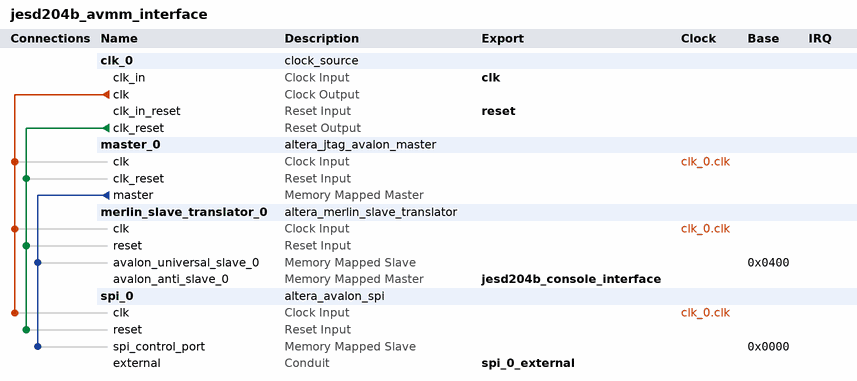
[diagram p0: system contents]
# Platform Designer (Qsys) system jesd204b_avmm_interface, Arria V 5AGTFD7K3F40I3
# Parameters at their usual value, and those the tool derives, are not listed.
package require -exact qsys 14.0
create_system jesd204b_avmm_interface
set_project_property DEVICE_FAMILY {Arria V}
set_project_property DEVICE 5AGTFD7K3F40I3

add_instance clk_0 clock_source 14.0
set_instance_parameter_value clk_0 clockFrequency 100000000

add_instance master_0 altera_jtag_avalon_master 14.0

add_instance merlin_slave_translator_0 altera_merlin_slave_translator 14.0
set_instance_parameter_value merlin_slave_translator_0 AV_ADDRESS_W 10
set_instance_parameter_value merlin_slave_translator_0 AV_DATA_W 32
set_instance_parameter_value merlin_slave_translator_0 UAV_DATA_W 32
set_instance_parameter_value merlin_slave_translator_0 AV_BURSTCOUNT_W 4
set_instance_parameter_value merlin_slave_translator_0 AV_BYTEENABLE_W 4
set_instance_parameter_value merlin_slave_translator_0 UAV_BYTEENABLE_W 4
set_instance_parameter_value merlin_slave_translator_0 UAV_ADDRESS_W 10
set_instance_parameter_value merlin_slave_translator_0 UAV_BURSTCOUNT_W 4
set_instance_parameter_value merlin_slave_translator_0 AV_READLATENCY 1
set_instance_parameter_value merlin_slave_translator_0 AV_SETUP_WAIT 0
set_instance_parameter_value merlin_slave_translator_0 AV_WRITE_WAIT 0
set_instance_parameter_value merlin_slave_translator_0 AV_READ_WAIT 1
set_instance_parameter_value merlin_slave_translator_0 AV_DATA_HOLD 0
set_instance_parameter_value merlin_slave_translator_0 AV_TIMING_UNITS 1
set_instance_parameter_value merlin_slave_translator_0 USE_READDATA 1
set_instance_parameter_value merlin_slave_translator_0 USE_WRITEDATA 1
set_instance_parameter_value merlin_slave_translator_0 USE_READ 1
set_instance_parameter_value merlin_slave_translator_0 USE_WRITE 1
set_instance_parameter_value merlin_slave_translator_0 USE_BEGINBURSTTRANSFER 0
set_instance_parameter_value merlin_slave_translator_0 USE_BEGINTRANSFER 0
set_instance_parameter_value merlin_slave_translator_0 USE_BYTEENABLE 0
set_instance_parameter_value merlin_slave_translator_0 USE_CHIPSELECT 1
set_instance_parameter_value merlin_slave_translator_0 USE_ADDRESS 1
set_instance_parameter_value merlin_slave_translator_0 USE_BURSTCOUNT 0
set_instance_parameter_value merlin_slave_translator_0 USE_READDATAVALID 0
set_instance_parameter_value merlin_slave_translator_0 USE_WAITREQUEST 1
set_instance_parameter_value merlin_slave_translator_0 USE_WRITEBYTEENABLE 0
set_instance_parameter_value merlin_slave_translator_0 USE_LOCK 0
set_instance_parameter_value merlin_slave_translator_0 USE_AV_CLKEN 0
set_instance_parameter_value merlin_slave_translator_0 USE_UAV_CLKEN 0
set_instance_parameter_value merlin_slave_translator_0 USE_OUTPUTENABLE 0
set_instance_parameter_value merlin_slave_translator_0 USE_DEBUGACCESS 0
set_instance_parameter_value merlin_slave_translator_0 USE_READRESPONSE 0
set_instance_parameter_value merlin_slave_translator_0 USE_WRITERESPONSE 0
set_instance_parameter_value merlin_slave_translator_0 AV_SYMBOLS_PER_WORD 4
set_instance_parameter_value merlin_slave_translator_0 AV_ADDRESS_SYMBOLS 1
set_instance_parameter_value merlin_slave_translator_0 AV_BURSTCOUNT_SYMBOLS 1
set_instance_parameter_value merlin_slave_translator_0 AV_CONSTANT_BURST_BEHAVIOR 0
set_instance_parameter_value merlin_slave_translator_0 UAV_CONSTANT_BURST_BEHAVIOR 0
set_instance_parameter_value merlin_slave_translator_0 AV_REQUIRE_UNALIGNED_ADDRESSES 0
set_instance_parameter_value merlin_slave_translator_0 AV_LINEWRAPBURSTS 0
set_instance_parameter_value merlin_slave_translator_0 AV_MAX_PENDING_READ_TRANSACTIONS 64
set_instance_parameter_value merlin_slave_translator_0 AV_MAX_PENDING_WRITE_TRANSACTIONS 0
set_instance_parameter_value merlin_slave_translator_0 AV_BURSTBOUNDARIES 0
set_instance_parameter_value merlin_slave_translator_0 AV_INTERLEAVEBURSTS 0
set_instance_parameter_value merlin_slave_translator_0 AV_BITS_PER_SYMBOL 8
set_instance_parameter_value merlin_slave_translator_0 AV_ISBIGENDIAN 0
set_instance_parameter_value merlin_slave_translator_0 AV_ADDRESSGROUP 0
set_instance_parameter_value merlin_slave_translator_0 UAV_ADDRESSGROUP 0
set_instance_parameter_value merlin_slave_translator_0 AV_REGISTEROUTGOINGSIGNALS 0
set_instance_parameter_value merlin_slave_translator_0 AV_REGISTERINCOMINGSIGNALS 0
set_instance_parameter_value merlin_slave_translator_0 AV_ALWAYSBURSTMAXBURST 0
set_instance_parameter_value merlin_slave_translator_0 CHIPSELECT_THROUGH_READLATENCY 0
set_instance_parameter_value merlin_slave_translator_0 CLOCK_RATE 100000000

add_instance spi_0 altera_avalon_spi 14.0
set_instance_parameter_value spi_0 clockPolarity 0
set_instance_parameter_value spi_0 dataWidth 32
set_instance_parameter_value spi_0 masterSPI true
set_instance_parameter_value spi_0 numberOfSlaves 1
set_instance_parameter_value spi_0 targetClockRate 1000000

# connections
add_connection clk_0.clk master_0.clk clock
add_connection clk_0.clk merlin_slave_translator_0.clk clock
add_connection clk_0.clk spi_0.clk clock
add_connection clk_0.clk_reset master_0.clk_reset reset
add_connection clk_0.clk_reset merlin_slave_translator_0.reset reset
add_connection clk_0.clk_reset spi_0.reset reset
add_connection master_0.master merlin_slave_translator_0.avalon_universal_slave_0 avalon
set_connection_parameter_value master_0.master/merlin_slave_translator_0.avalon_universal_slave_0 baseAddress 0x0400
add_connection master_0.master spi_0.spi_control_port avalon
set_connection_parameter_value master_0.master/spi_0.spi_control_port baseAddress 0x0000

# exported interfaces
add_interface clk clock sink
set_interface_property clk EXPORT_OF clk_0.clk_in
add_interface reset reset sink
set_interface_property reset EXPORT_OF clk_0.clk_in_reset
add_interface jesd204b_console_interface avalon master
set_interface_property jesd204b_console_interface EXPORT_OF merlin_slave_translator_0.avalon_anti_slave_0
add_interface spi_0_external conduit end
set_interface_property spi_0_external EXPORT_OF spi_0.external

set_interconnect_requirement {$system} qsys_mm.clockCrossingAdapter HANDSHAKE
set_interconnect_requirement {$system} qsys_mm.maxAdditionalLatency 1
set_interconnect_requirement {$system} qsys_mm.insertDefaultSlave false

save_system jesd204b_avmm_interface.qsys
